# EAGLE design Counter (EAGLE 9.1.1)
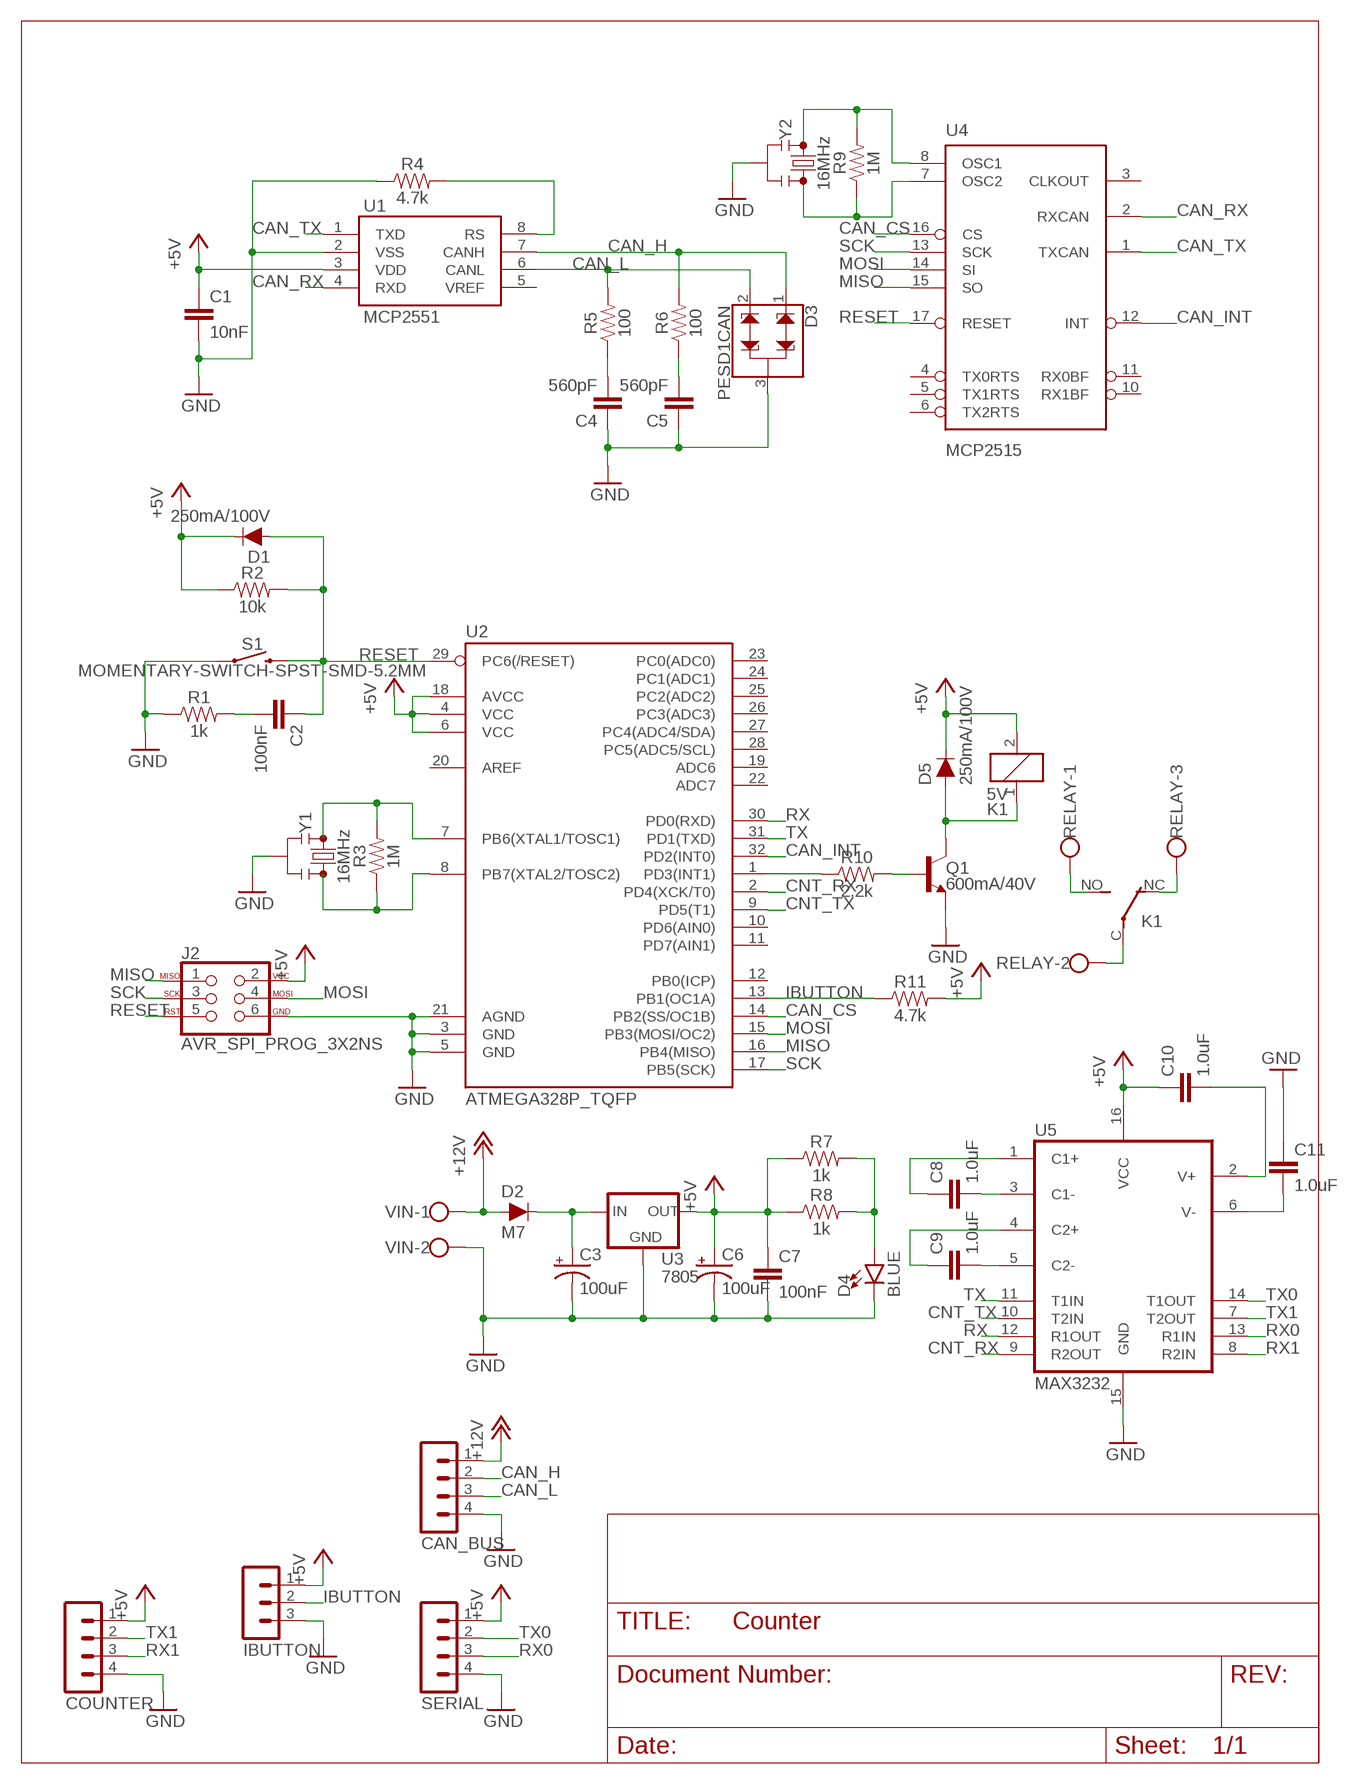
[diagram p0: schematic, sheet 1]

## Parts
C1  10nF  47NF-0603-25V-5%  [0603]
C2  100nF  47NF-0603-25V-5%  [0603]
C3  100uF  47UF-POLAR-PANASONIC_D-35V-20%  [PANASONIC_D]
C4  560pF  560PF-0603-50V-5%  [0603]
C5  560pF  560PF-0603-50V-5%  [0603]
C6  100uF  47UF-POLAR-PANASONIC_D-35V-20%  [PANASONIC_D]
C7  100nF  47NF-0603-25V-5%  [0603]
C8  1.0uF  1.0UF-0603-16V-10%  [0603]
C9  1.0uF  1.0UF-0603-16V-10%  [0603]
C10  1.0uF  1.0UF-0603-16V-10%  [0603]
C11  1.0uF  1.0UF-0603-16V-10%  [0603]
CAN_BUS  MA04-1  [MA04-1]
COUNTER  MA04-1  [MA04-1]
D1  250mA/100V  DIODE-BAS16J  [SOD-323]
D2  M7  DIODE-BAS16J  [SOD-323]
D3  PESD1CAN  [SOT23-3]
D4  BLUE  LED-BLUE0603  [LED-0603]
D5  250mA/100V  DIODE-BAS16J  [SOD-323]
IBUTTON  MA03-1  [MA03-1]
J2  AVR_SPI_PROG_3X2NS  [2X3-NS]
K1  5V  CQ1-12V  [CQ1]
Q1  600mA/40V  TRANS_NPN-MMBT2222AL  [SOT23-3]
R1  1k  1KOHM-0603-1/10W-1%  [0603]
R2  10k  10KOHM-0603-1/10W-1%  [0603]
R3  1M  1MOHM-0603-1/4W-5%  [0603]
R4  4.7k  4.7KOHM-0603-1/10W-1%  [0603]
R5  100  100OHM-0603-1/10W-1%  [0603]
R6  100  100OHM-0603-1/10W-1%  [0603]
R7  1k  1KOHM-0603-1/10W-1%  [0603]
R8  1k  1KOHM-0603-1/10W-1%  [0603]
R9  1M  1MOHM-0603-1/4W-5%  [0603]
R10  2.2k  2.2KOHM-0603-1/10W-1%  [0603]
R11  4.7k  4.7KOHM-0603-1/10W-1%  [0603]
RELAY  W237-103  [W237-103]
S1  MOMENTARY-SWITCH-SPST-SMD-5.2MM  [TACTILE_SWITCH_SMD_5.2MM]
SERIAL  MA04-1  [MA04-1]
U1  MCP2551  [SO08]
U2  ATMEGA328P_TQFP  [TQFP32-08]
U3  7805  V_REG_78XX7812  [TO-252]
U4  MCP2515  MCP2515(MCP2510)SO  [SO18W]
U5  MAX3232  MAX2323SOIC16  [SO16]
VIN  W237-102  [W237-102]
Y1  16MHz  RESONATOR-16MHZSMD_3.2X1.3  [RESONATOR-SMD-3.2X1.3]
Y2  16MHz  RESONATOR-16MHZSMD_3.2X1.3  [RESONATOR-SMD-3.2X1.3]

## Nets
+5V: C1.1 C6.+ C7.1 C10.1 COUNTER.1 D1.C D5.C IBUTTON.1 J2.2 K1.2 R2.1 R7.1 R8.1 R11.2 SERIAL.1 U1.3(VDD) U2.4(VCC) U2.6(VCC) U2.18(AVCC) U3.2(OUT) U5.16(VCC)
+12V: CAN_BUS.1 D2.A VIN.1
CAN_CS: U2.14(PB2(SS/OC1B)) U4.16(CS)
CAN_H: CAN_BUS.2 D3.1 R6.2 U1.7(CANH)
CAN_INT: U2.32(PD2(INT0)) U4.12(INT)
CAN_L: CAN_BUS.3 D3.2 R5.2 U1.6(CANL)
CAN_RX: U1.4(RXD) U4.2(RXCAN)
CAN_TX: U1.1(TXD) U4.1(TXCAN)
CNT_RX: U2.2(PD4(XCK/T0)) U5.9(R2OUT)
CNT_TX: U2.9(PD5(T1)) U5.10(T2IN)
GND: C1.2 C3.- C4.1 C5.1 C6.- C7.2 C11.1 CAN_BUS.4 COUNTER.4 D3.3 D4.C IBUTTON.3 J2.6 Q1.2(E) R1.1 R4.1 S1.1 SERIAL.4 U1.2(VSS) U2.3(GND) U2.5(GND) U2.21(AGND) U3.3(GND) U5.15(GND) VIN.2 Y1.2 Y2.2
IBUTTON: IBUTTON.2 R11.1 U2.13(PB1(OC1A))
MISO: J2.1 U2.16(PB4(MISO)) U4.15(SO)
MOSI: J2.4 U2.15(PB3(MOSI/OC2)) U4.14(SI)
N$1: R3.1 U2.8(PB7(XTAL2/TOSC2)) Y1.3
N$2: C3.+ D2.C U3.1(IN)
N$3: R3.2 U2.7(PB6(XTAL1/TOSC1)) Y1.1
N$4: D4.A R7.2 R8.2
N$5: R4.2 U1.8(RS)
N$6: C2.2 R1.2
N$7: K1.NO(2:S) RELAY.1
N$8: C5.2 R6.1
N$9: C4.2 R5.1
N$10: K1.NC(2:O) RELAY.3
N$11: K1.C(2:P) RELAY.2
N$12: Q1.1(B) R10.2
N$13: D5.A K1.1 Q1.3(C)
N$14: R10.1 U2.1(PD3(INT1))
N$15: C8.2 U5.3(C1-)
N$16: C8.1 U5.1(C1+)
N$17: R9.1 U4.7(OSC2) Y2.3
N$18: R9.2 U4.8(OSC1) Y2.1
N$19: C9.1 U5.4(C2+)
N$20: C9.2 U5.5(C2-)
N$21: C11.2 U5.6(V-)
N$22: C10.2 U5.2(V+)
RESET: C2.1 D1.A J2.5 R2.2 S1.3 U2.29(PC6(/RESET)) U4.17(RESET)
RX: U2.30(PD0(RXD)) U5.12(R1OUT)
RX0: SERIAL.3 U5.13(R1IN)
RX1: COUNTER.3 U5.8(R2IN)
SCK: J2.3 U2.17(PB5(SCK)) U4.13(SCK)
TX: U2.31(PD1(TXD)) U5.11(T1IN)
TX0: SERIAL.2 U5.14(T1OUT)
TX1: COUNTER.2 U5.7(T2OUT)
Unconnected: U1.5(VREF) U2.10(PD6(AIN0)) U2.11(PD7(AIN1)) U2.12(PB0(ICP)) U2.19(ADC6) U2.20(AREF) U2.22(ADC7) U2.23(PC0(ADC0)) U2.24(PC1(ADC1)) U2.25(PC2(ADC2)) U2.26(PC3(ADC3)) U2.27(PC4(ADC4/SDA)) U2.28(PC5(ADC5/SCL)) U4.3(CLKOUT) U4.4(TX0RTS) U4.5(TX1RTS) U4.6(TX2RTS) U4.10(RX1BF) U4.11(RX0BF)

## Power pins joined to a net without a drawn wire
+5V: U4.18(VDD)
GND: U4.9(VSS)

## Library data of the parts
C1 C2 C7 = SparkFun-Capacitors:47NF: 47nF ceramic capacitors A capacitor is a passive two-terminal electrical component used to store electrical energy temporarily in an electric field.; PROD_ID: CAP-08605; VALUE: 47nF
C3 C6 = SparkFun-Capacitors:47UF-POLAR: 47µF polarized capacitors A capacitor is a passive two-terminal electrical component used to store electrical energy temporarily in an electric field.; PROD_ID: CAP-08478; VALUE: 47uF
C4 C5 = SparkFun-Capacitors:560PF: 0.56nF/560pF ceramic capacitors A capacitor is a passive two-terminal electrical component used to store electrical energy temporarily in an electric field.; PROD_ID: CAP-08749
C8-C11 = SparkFun-Capacitors:1.0UF: 1µF ceramic capacitors A capacitor is a passive two-terminal electrical component used to store electrical energy temporarily in an electric field.; PROD_ID: CAP-00868
CAN_BUS COUNTER SERIAL = con-lstb:MA04-1: PIN HEADER; OC_FARNELL: unknown; OC_NEWARK: unknown
D1 D5 = SparkFun-DiscreteSemi:DIODE: Diode These are standard reverse protection diodes and small signal diodes. SparkFun Products: SparkFun SparkPunk Sound Kit <https://www.sparkfun.com/products/11177> SparkFun ESP8266 Thing <https://www.sparkfun.com/products/13231>; PROD_ID: DIO-09646
D2 = SparkFun-DiscreteSemi:DIODE: Diode These are standard reverse protection diodes and small signal diodes. SparkFun Products: SparkFun SparkPunk Sound Kit <https://www.sparkfun.com/products/11177> SparkFun ESP8266 Thing <https://www.sparkfun.com/products/13231>; PROD_ID: DIO-09646; VALUE: 250mA/100V
D3 = SparkFun-DiscreteSemi:PESD1CAN: CAN bus ESD protection diode PESD1CAN is used to protect two CAN bus lines from ESD. Link to datasheet <http://www.nxp.com/documents/data_sheet/PESD1CAN-U.pdf> SparkFun Products: SparkFun CAN-BUS Shield <https://www.sparkfun.com/products/13262>; PROD_ID: DIO-12501
D4 = SparkFun-LED:LED-BLUE: Blue SMD LED Used in manufacturing of various products at SparkFun Packages: 0603 - SMD 0603 package [Product Link] <http://www.digikey.com/product-detail/en/SMLE12BC7TT86/511-1589-2-ND/1641808> 1206 - SMD1206 package [Product Link] <http://www.digikey.com/product-detail/en/lite-on-inc/LTST-C150TBKT/160-1643-1-ND/573584> SparkFun Products: ESP8266 Thing-Dev Board <https://www.sparkfun.com/products/13711> RedBoard <https://www.sparkfun.com/products/12757>; PROD_ID: DIO-08575
IBUTTON = con-lstb:MA03-1: PIN HEADER; OC_FARNELL: unknown; OC_NEWARK: unknown
J2 = SparkFun-Connectors:AVR_SPI_PROG_3X2: AVR ISP 6 Pin This is the reduced ISP connector for AVR programming. Common on Arduino. This footprint will take up less PCB space and can be used with a 10-pin to 6-pin adapter such as SKU: BOB-08508 **Special note about "TEST_POINT" package. The stop mask is on the top side, so if you want your programming test points to be on the bottom of your board, make sure to place this package on the bottom side of the board. This also ensure that the orientation to program from the bottom side will be correct. SparkFun Products: SparkFun ISP Pogo Adapter <https://www.sparkfun.com/products/11591> - NS Tiny AVR Programmer <https://www.sparkfun.com/products/11801> -PTH
K1 = relay:CQ1-12V: AUTOMOTIVE QUIET RELAY NAiS Source: http://www.mew-europe.com/.. en_ds_61208_0000.pdf; OC_FARNELL: unknown; OC_NEWARK: unknown
Q1 = SparkFun-DiscreteSemi:TRANS_NPN: NPN transistor Current controlled devices typically used to amplify current or used as a switch. BC547 - COM-08928 <http://www.sparkfun.com/products/8928> (TO-92 45V 100mA) (1.Collector 2.Base 3.Emitter) 2N3904 - COM-00521 <http://www.sparkfun.com/products/521> (TO-92 40V 200mA) (1.Emitter 2.Base 3.Collector) P2N2222A - COM-12852 <http://www.sparkfun.com/products/12852> (TO-92 40V 600mA) (1.Collector 2.Base 3.Emitter); PROD_ID: TRANS-08049
R1 R7 R8 = SparkFun-Resistors:1KOHM: 1kΩ resistor A resistor is a passive two-terminal electrical component that implements electrical resistance as a circuit element. Resistors act to reduce current flow, and, at the same time, act to lower voltage levels within circuits. - Wikipedia; PROD_ID: RES-07856
R2 = SparkFun-Resistors:10KOHM: 10kΩ resistor A resistor is a passive two-terminal electrical component that implements electrical resistance as a circuit element. Resistors act to reduce current flow, and, at the same time, act to lower voltage levels within circuits. - Wikipedia; PROD_ID: RES-00824
R3 R9 = SparkFun-Resistors:1MOHM: 1MΩ resistor A resistor is a passive two-terminal electrical component that implements electrical resistance as a circuit element. Resistors act to reduce current flow, and, at the same time, act to lower voltage levels within circuits. - Wikipedia; PROD_ID: RES-07868
R4 R11 = SparkFun-Resistors:4.7KOHM: 4.7kΩ resistor A resistor is a passive two-terminal electrical component that implements electrical resistance as a circuit element. Resistors act to reduce current flow, and, at the same time, act to lower voltage levels within circuits. - Wikipedia; PROD_ID: RES-07857
R5 R6 = SparkFun-Resistors:100OHM: 100Ω resistor A resistor is a passive two-terminal electrical component that implements electrical resistance as a circuit element. Resistors act to reduce current flow, and, at the same time, act to lower voltage levels within circuits. - Wikipedia; PROD_ID: RES-07863
R10 = SparkFun-Resistors:2.2KOHM: 2.2kΩ resistor A resistor is a passive two-terminal electrical component that implements electrical resistance as a circuit element. Resistors act to reduce current flow, and, at the same time, act to lower voltage levels within circuits. - Wikipedia; PROD_ID: RES-08272
RELAY = con-wago-500:W237-103: WAGO SCREW CLAMP; MPN: 237-103; OC_FARNELL: unknown; OC_NEWARK: 18M7116
S1 = SparkFun-Switches:MOMENTARY-SWITCH-SPST: Momentary Switch (Pushbutton) - SPST Normally-open (NO) SPST momentary switches (buttons, pushbuttons). Variants PTH-12MM - 12mm square, through-hole Momentary Pushbutton Switch - 12mm Square <https://www.sparkfun.com/products/9190> (COM-09190) PTH-6.0MM, PTH-6.0MM-KIT - 6.0mm square, through-hole Mini Pushbutton Switch <https://www.sparkfun.com/products/97> (COM-00097) KIT package intended for soldering kit's - only one side of pads' copper is exposed. PTH-RIGHT-ANGLE-KIT - Right-angle, through-hole Right Angle Tactile Button <https://www.sparkfun.com/products/10791> - Used on SparkFun BigTime Watch Kit <https://www.sparkfun.com/products/11734> SMD-12MM - 12mm square, surface-mount Tactile Button - SMD (12mm) <https://www.sparkfun.com/products/12993> (COM-12993) Used on SparkFun PicoBoard <https://www.sparkfun.com/products/11888> SMD-4.5MM - 4.5mm Square Trackball Switch Used on SparkFun Blackberry Trackballer Breakout <https://www.sparkfun.com/products/13169> SMD-4.6MMX2.8MM - 4.60mm x 2.80mm, surface mount Used on SparkFun SAMD21 Mini Breakout <https://www.sparkfun.com/products/13664> SMD-5.2MM, SMD-5.2-REDUNDANT - 5.2mm square, surface-mount Mini Pushbutton Switch - SMD <https://www.sparkfun.com/products/8720> (COM-08720) Used on Arduino Pro Mini <https://www.sparkfun.com/products/11114> REDUNDANT package connects both switch circuits together SMD-6.0X3.5MM - 6.0 x 3.5mm, surface mount Momentary Reset Switch SMD <https://www.sparkfun.com/products/8229> (COM-08229) SMD-6.2MM-TALL - 6.2mm square, surface mount Tactile Button - SMD (6mm) <https://www.sparkfun.com/products/12992> Used on SparkFun Digital Sandbox <https://www.sparkfun.com/products/12651> SMD-RIGHT-ANGLE - Right-angle, surface mount Used on SparkFun Block for Intel® Edison - Arduino <https://www.sparkfun.com/products/13036>; PROD_ID: SWCH-08247; SF_SKU: COM-08720
U1 = SparkFun-IC-Comms:MCP2551: MCP2551 High Speed CAN Transceiver High speed CAN transceiver Datasheet <http://www.sparkfun.com/datasheets/DevTools/Arduino/MCP2551.pdf> SparkFun Products CAN-BUS Shield <https://www.sparkfun.com/products/13262> (DEV-13262) SparkFun OBD-II UART <https://www.sparkfun.com/products/9555> (WIG-09555); PROD_ID: IC-09907
U2 = SparkFun-IC-Microcontroller:ATMEGA328P_TQFP: Popular 328P in QFP Storefront component: ATmega328 - TQFP <https://www.sparkfun.com/products/13448> (COM-13448) Datasheet <http://www.sparkfun.com/datasheets/Components/SMD/ATMega328.pdf> SparkFun Products SparkFun RedBoard - Programmed with Arduino <https://www.sparkfun.com/products/12757> (DEV-12757) Arduino Pro Mini 328 - 5V/16MHz <https://www.sparkfun.com/products/11113> (DEV-11113) Arduino Pro Mini 328 - 3.3V/8MHz <https://www.sparkfun.com/products/11114> (DEV-11114) SparkFun OpenLog <https://www.sparkfun.com/products/13712> (DEV-13712) SparkFun MicroView - OLED Arduino Module <https://www.sparkfun.com/products/12923> (DEV-12923) SparkFun Digital Sandbox <https://www.sparkfun.com/products/12651> (DEV-12651) SparkFun PicoBoard <https://www.sparkfun.com/products/11888> (WIG-11888) Arduino Fio <https://www.sparkfun.com/products/10116> (DEV-10116) LilyPad Arduino 328 Main Board <https://www.sparkfun.com/products/13342> (DEV-13342) SparkFun RedStick <https://www.sparkfun.com/products/13741> (DEV-13741) LilyPad MP3 <https://www.sparkfun.com/products/11013> (DEV-11013) LilyPad Arduino SimpleSnap <https://www.sparkfun.com/products/10941> (DEV-10941) SparkFun Stepoko <https://www.sparkfun.com/products/13899> (ROB-13899) SparkFun Geiger Counter <https://www.sparkfun.com/products/11345> (SEN-11345) SparkFun EL Sequencer <https://www.sparkfun.com/products/12781> (COM-12781) Arduino Pro 328 - 5V/16MHz <https://www.sparkfun.com/products/10915> (DEV-10915) CryptoCape <https://www.sparkfun.com/products/12773> (DEV-12773) SparkFun IR Thermometer Evaluation Board - MLX90614 <https://www.sparkfun.com/products/10740> (SEN-10740) SparkFun RedBot Mainboard <https://www.sparkfun.com/products/12097> (ROB-12097) Arduino Pro 328 - 3.3V/8MHz <https://www.sparkfun.com/products/10914> (DEV-10914) SparkFun Block for Intel® Edison - Arduino <https://www.sparkfun.com/products/13036> (DEV-13036) SparkFun Simon Says - Surface Mount Soldering Kit <https://www.sparkfun.com/products/10935> (KIT-10935) SparkFun 7-Segment Serial Display - Red <https://www.sparkfun.com/products/11441> (COM-11441) SparkFun 7-Segment Serial Display - White <https://www.sparkfun.com/products/11629> (COM-11629) SparkFun 7-Segment Serial Display - Yellow <https://www.sparkfun.com/products/11443> (COM-11443) SparkFun 7-Segment Serial Display - Kelly Green <https://www.sparkfun.com/products/11440> (COM-11440) SparkFun 7-Segment Serial Display - Blue <https://www.sparkfun.com/products/11442> (COM-11442) SparkFun OpenSegment Serial Display - 20mm (Blue) <https://www.sparkfun.com/products/11647> (COM-11647) SparkFun OpenSegment Serial Display - 20mm (Green) <https://www.sparkfun.com/products/11646> (COM-11646) SparkFun OpenSegment Serial Display - 20mm (White) <https://www.sparkfun.com/products/11648> (COM-11648) SparkFun OpenSegment Serial Display - 20mm (Red) <https://www.sparkfun.com/products/11644> (COM-11644) SparkFun OpenSegment Serial Display - 20mm (Yellow) <https://www.sparkfun.com/products/11645> (COM-11645) SparkFun OpenSegment Shield <https://www.sparkfun.com/products/13190> (DEV-13190); PROD_ID: IC-09069
U3 = SparkFun-IC-Power:V_REG_78XX: Voltage Regulator Standard 78xx regulator. IGO (Input Ground Output). Spark Fun Electronics SKU : COM-00107; PROD_ID: VREG-12370; VALUE: +12v
U4 = SparkFun-IC-Comms:MCP2515(MCP2510): CAN controller with SPI interface The MCP2515 controller supercedes the MCP2510 while addressing all errata associated with it. The two devices are pin compatible, either can be used with this device. 18-pin package SOIC Simple SPI interface to any MCU. One-shot mode ensures message transmission is attempted only once Databyte filtering Start-of-Frame (SOF) output Low-power CMOS Technology Datasheet <http://www.sparkfun.com/datasheets/DevTools/Arduino/MCP2515.pdf> SparkFun Products CAN-BUS Shield <https://www.sparkfun.com/products/13262> (DEV-13262); PROD_ID: IC-09906
U5 = SparkFun-IC-Comms:MAX2323: RS232 Transceiver This part covers 232 drivers that are compatible with the MAX3232. Sipex SP3232EB Datasheet <http://cdn.sparkfun.com/datasheets/Components/General%20IC/SP3232EBCA-L.pdf> SparkFun Products SOIC component <https://www.sparkfun.com/products/589> (COM-00589 / IC-08171) Retired DIP component (COM-00316 / IC-08446) SparkFun Transceiver Breakout - MAX3232 <https://www.sparkfun.com/products/11189> (BOB-11189) SparkFun XBee Explorer Serial <https://www.sparkfun.com/products/13225> (WRL-13225); PROD_ID: IC-08171
VIN = con-wago-500:W237-102: WAGO SCREW CLAMP; MPN: 237-102; OC_FARNELL: unknown; OC_NEWARK: 70K9898
Y1 Y2 = SparkFun-Clocks:RESONATOR-16MHZ: 16MHz Resonator Digikey Example <http://www.digikey.com/product-detail/en/murata-electronics-north-america/CSTCE16M0V53-R0/490-1198-1-ND/584635> Frequency: 16MHz Frequency Stability: ±0.3% Frequency Tolerance: ±0.5% Capacitance: 15pF SparkFun Products SparkFun OpenLog <https://www.sparkfun.com/products/13712> SparkFun MicroView - OLED Arduino Module <https://www.sparkfun.com/products/12923>; PROD_ID: XTAL-08900

## Board
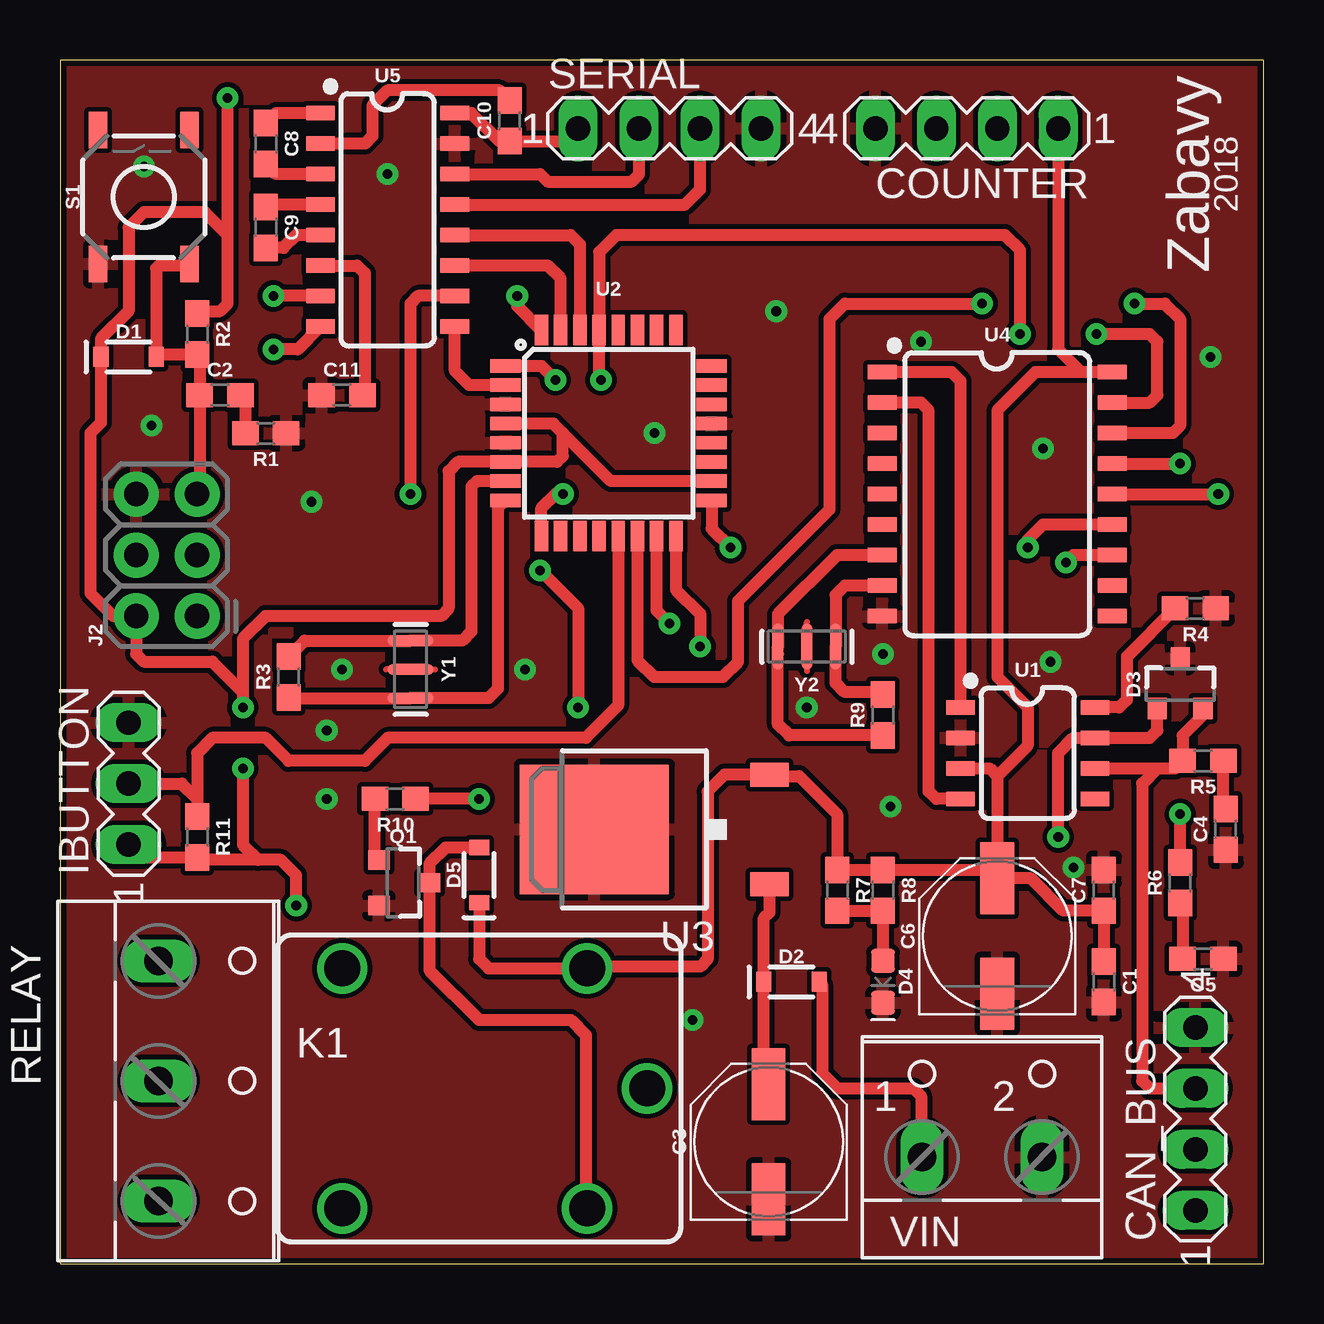
[diagram p1: board, top side]
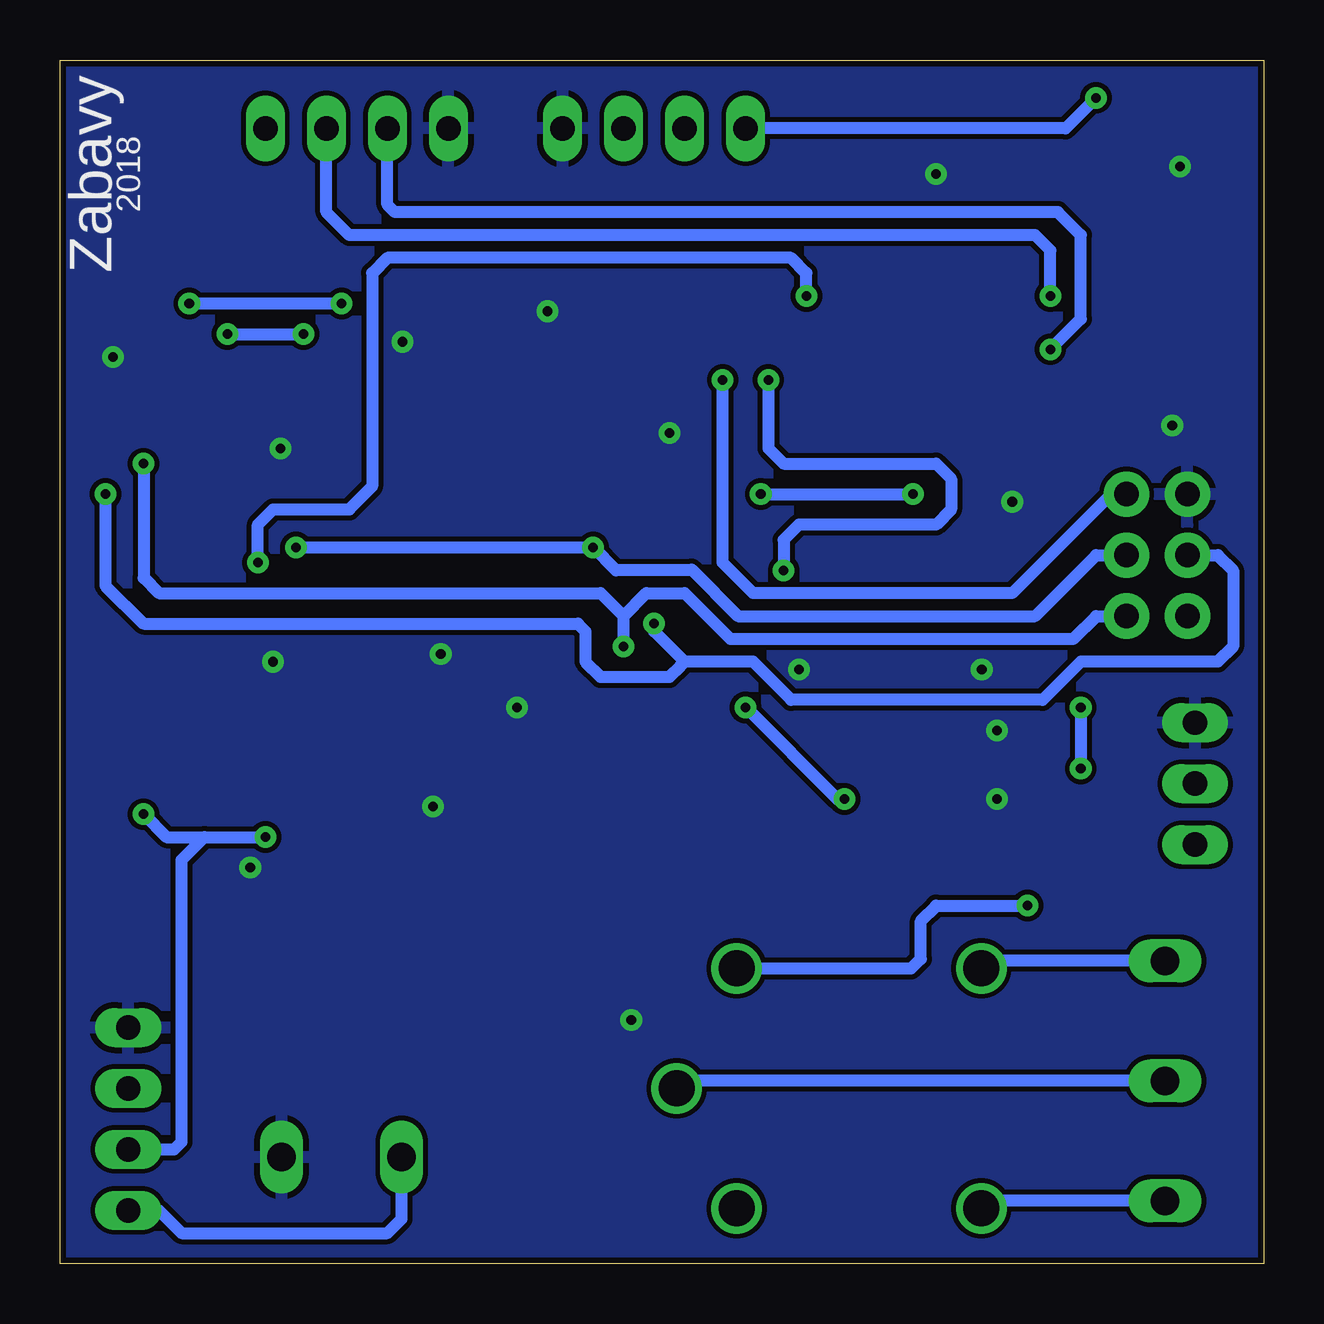
[diagram p2: board, bottom side, seen from below]

Size 50.15 x 50.16 mm. Coordinates in mm from the lower left corner, seen from the top.
Outline: 0,0 50.15,0 50.15,50.16 0,50.16 0,0
Copper layers (1*16): Top 0.035mm / dielectric 1.5mm / Bottom 0.035mm
Design rules "REVISION COLCIRCUITOS": minimum track width 0.23mm, minimum drill 0.4mm, track to track 0.2mm, track to pad 0.2mm, pad to pad 0.2mm, via to via 0.2mm, smd to smd 0mil, copper to edge 0.25mm, drill to drill 0.4mm, minimum pad ring 0.3mm, minimum via ring 0.25mm, stop-mask expansion 0.15mm, vias tented up to drill 0.001mm, thermal gap 10mil

### Footprints (pad centres in the part's own frame; a part is rotated, then mirrored left to right if it is on the bottom)
0603 = smd 1.1 x 1: 1 -0.85,0; 2 0.85,0
PANASONIC_D = smd 3 x 1.4: + 2.4,0; - -2.4,0
MA04-1 = drill 1.016 long: 1 -3.81,0; 2 -1.27,0; 3 1.27,0; 4 3.81,0
SOD-323 = smd 0.63 x 0.83: A 1.15,0; C -1.15,0
SOT23-3 = smd 0.8 x 0.9: 1 -0.95,-1; 2 0.95,-1; 3 0,1.1
LED-0603 = smd 1 x 1: A -0.877,0; C 0.877,0
MA03-1 = drill 1.016 long: 1 -2.54,0; 2 0,0; 3 2.54,0
2X3-NS = drill 1.016 pad 1.88: 1 -2.54,-1.27; 2 -2.54,1.27; 3 0,-1.27; 4 0,1.27; 5 2.54,-1.27; 6 2.54,1.27
CQ1 = drill 1.5: 1 4.5,-5; 2 4.5,5; C 7,0; NC -5.7,-5; NO -5.7,5
W237-103 = drill 1.194 long: 1 -5,-1.29; 2 0,-1.29; 3 5,-1.29
TACTILE_SWITCH_SMD_5.2MM = smd 1.524 x 0.762: 1 -2.794,1.905; 2 2.794,1.905; 3 -2.794,-1.905; 4 2.794,-1.905
SO08 = smd 0.6 x 1.2: 1 -1.905,-2.8; 2 -0.635,-2.8; 3 0.635,-2.8; 4 1.905,-2.8; 5 1.905,2.8; 6 0.635,2.8; 7 -0.635,2.8; 8 -1.905,2.8
TQFP32-08 = smd 1.27 x 0.559: 1 -4.293,2.8; 2 -4.293,2; 3 -4.293,1.2; 4 -4.293,0.4; 5 -4.293,-0.4; 6 -4.293,-1.2; 7 -4.293,-2; 8 -4.293,-2.8; 17 4.293,-2.8; 18 4.293,-2; 19 4.293,-1.2; 20 4.293,-0.4; 21 4.293,0.4; 22 4.293,1.2; 23 4.293,2; 24 4.293,2.8 | smd 0.559 x 1.27: 9 -2.8,-4.293; 10 -2,-4.293; 11 -1.2,-4.293; 12 -0.4,-4.293; 13 0.4,-4.293; 14 1.2,-4.293; 15 2,-4.293; 16 2.8,-4.293; 25 2.8,4.293; 26 2,4.293; 27 1.2,4.293; 28 0.4,4.293; 29 -0.4,4.293; 30 -1.2,4.293; 31 -2,4.293; 32 -2.8,4.293
TO-252 = smd 1 x 1.6: 1 -2.28,-4.8; 2 2.28,-4.8 | smd 5.4 x 6.2: 3 0,2.5
SO18W = smd 0.6 x 1.2: 1 -5.08,-4.788; 2 -3.81,-4.788; 3 -2.54,-4.788; 4 -1.27,-4.788; 5 0,-4.788; 6 1.27,-4.788; 7 2.54,-4.788; 8 3.81,-4.788; 9 5.08,-4.788; 10 5.08,4.788; 11 3.81,4.788; 12 2.54,4.788; 13 1.27,4.788; 14 0,4.788; 15 -1.27,4.788; 16 -2.54,4.788; 17 -3.81,4.788; 18 -5.08,4.788
SO16 = smd 0.6 x 1.2: 1 -4.445,-2.8; 2 -3.175,-2.8; 3 -1.905,-2.8; 4 -0.635,-2.8; 5 0.635,-2.8; 6 1.905,-2.8; 7 3.175,-2.8; 8 4.445,-2.8; 9 4.445,2.8; 10 3.175,2.8; 11 1.905,2.8; 12 0.635,2.8; 13 -0.635,2.8; 14 -1.905,2.8; 15 -3.175,2.8; 16 -4.445,2.8
W237-102 = drill 1.194 long: 1 -2.5,-1.27; 2 2.5,-1.27
RESONATOR-SMD-3.2X1.3 = smd 0.45 x 1.905: 1 -1.2,0; 2 0,0; 3 1.2,0

### Placement (x,y rotation side)
C1  43.5,11.75 270 top
C2  6.67,36.2 0 top
C3  29.53,5.08 90 top
C4  48.58,18.1 90 top
C5  47.62,12.7 180 top
C6  39.05,13.65 90 top
C7  43.5,15.56 90 top
C8  8.57,46.67 270 top
C9  8.57,43.18 270 top
C10  18.73,47.62 90 top
C11  11.75,36.2 0 top
CAN_BUS  47.31,6.03 90 top
COUNTER  37.78,47.31 180 top
D1  2.86,37.78 0 top
D2  30.48,11.75 0 top
D3  46.67,24.13 0 top
D4  34.29,11.75 270 top
D5  17.46,16.19 90 top
IBUTTON  2.86,20 90 top
J2  4.45,29.53 90 top
K1  17.46,7.3 0 top
Q1  14.29,15.88 270 top
R1  8.57,34.61 180 top
R2  5.71,38.73 270 top
R3  9.53,24.45 90 top
R4  47.31,27.3 180 top
R5  47.62,20.95 180 top
R6  46.67,15.88 90 top
R7  32.38,15.56 270 top
R8  34.29,15.56 270 top
R9  34.29,22.86 90 top
R10  13.97,19.37 180 top
R11  5.71,17.78 270 top
RELAY  5.4,7.62 270 top
S1  3.49,44.45 90 top
SERIAL  25.4,47.31 0 top
U1  40.32,21.27 270 top
U2  22.86,34.61 0 top
U3  24.77,18.1 90 top
U4  39.05,32.07 270 top
U5  13.65,43.5 270 top
VIN  38.42,5.71 0 top
Y1  14.61,24.77 270 top
Y2  31.11,25.72 180 top

### Tracks (layer width: path | path; a pad name or v marks a point on that pad's centre or on a via)
+5V  (via drill 0.4)
  Top 0.508: 38.82,16.28 38.7,16.41 R8.1 R7.1 32.38,18.73 30.8,20.32 29.62,20.32 U3.2 27.68,20.38 26.99,19.68 26.99,12.7 26.67,12.38 21.35,12.38 21.27,12.3 | 38.82,16.28 C6.+ 40.46,16.05 41.81,14.71 C7.1 C1.1 | 39.05,20.32 38.73,20.64 U1.3 | 39.05,20.32 39.05,16.51 38.82,16.28 | D5.C 17.46,12.7 17.86,12.3 21.27,12.3 | 21.27,12.3 K1.2 | IBUTTON.1 3.39,16.93 R11.2 5.82,16.83 8.26,16.83 | U4.18 42.55,37.15 | 42.55,37.15 40.64,37.15 39.05,35.56 39.05,24.45 40.32,23.18 40.32,21.59 39.05,20.32 | 20.95,34.61 20.95,33.66 20.71,33.41 U2.6 16.58,33.41 16.19,33.02 16.19,27.3 15.88,26.99 8.57,26.99 7.62,26.04 7.62,23.81 | U2.18 22.95,32.61 20.95,34.61 | v9.84,14.92 9.84,16.19 9.21,16.83 8.26,16.83 | U5.16 17.14,47.94 18.31,46.77 C10.1 21.06,46.77 SERIAL.1 | 7.62,23.81 6.35,25.08 3.49,25.08 3.17,25.4 J2.2 2.22,26.99 1.27,27.94 1.27,34.61 1.71,35.05 D1.C 1.71,38.54 2.86,39.69 2.86,43.18 3.49,43.81 6.03,43.81 6.99,42.86 | 7.62,23.81 v7.62,23.18 | v7.62,20.64 7.62,17.46 8.26,16.83 | 42.55,37.15 41.59,38.1 COUNTER.1 | R2.1 5.82,39.69 6.67,39.69 6.99,40.01 6.99,42.86 | 6.99,42.86 v6.99,48.58 | U2.4 20.55,35.01 20.95,34.61
  Bottom 0.508: K1.2 14.69,12.3 14.29,12.7 14.29,14.29 13.65,14.92 v9.84,14.92 | v7.62,23.18 v7.62,20.64 | v6.99,48.58 8.26,47.31 SERIAL.1
+12V
  Top 0.508: D2.A 31.75,11.63 31.75,7.94 32.38,7.3 35.56,7.3 35.88,6.99 35.88,4.49 VIN.1
  Bottom 0.508: CAN_BUS.1 46.04,2.22 45.09,1.27 36.51,1.27 35.92,1.86 VIN.1
CAN_CS  (via drill 0.4)
  Top 0.508: U2.14 24.06,25.15 24.77,24.45 27.62,24.45 28.26,25.08 28.26,27.62 32.07,31.43 32.07,39.37 32.7,40.01 v38.42,40.01 | v44.77,40.01 46.04,40.01 46.67,39.37 46.67,34.92 46.35,34.61 U4.16
  Bottom 0.508: v38.42,40.01 v44.77,40.01
CAN_H  (via drill 0.4)
  Top 0.508: D3.1 45.72,22.23 45.4,21.91 U1.7 42.23,21.91 41.59,21.27 v41.59,17.78 | R6.2 v46.67,18.73
  Bottom 0.508: CAN_BUS.2 45.4,4.76 45.09,5.08 45.09,16.83 44.13,17.78 | 44.13,17.78 v41.59,17.78 | v46.67,18.73 45.72,17.78 44.13,17.78
CAN_INT  (via drill 0.4)
  Top 0.508: U2.32 19.05,39.91 v19.05,40.32 | U4.12 42.23,29.53 v41.91,29.21
  Bottom 0.508: v19.05,40.32 19.05,41.27 19.68,41.91 36.51,41.91 37.15,41.27 37.15,32.38 38.1,31.43 41.27,31.43 41.91,30.8 v41.91,29.21
CAN_L
  Top 0.508: D3.2 47.62,22.86 46.77,22.01 R5.2 46.46,20.64 45.72,20.64 | U1.6 45.72,20.64 | 45.72,20.64 45.09,20 45.09,7.62 45.4,7.3 CAN_BUS.3
CAN_RX
  Top 0.508: U1.4 36.51,19.37 36.2,19.68 36.2,35.56 35.88,35.88 U4.2
CAN_TX
  Top 0.508: U1.1 37.52,36.77 37.15,37.15 U4.1
CNT_RX
  Top 0.508: U2.2 17.05,36.61 16.45,37.2 U5.9
CNT_TX  (via drill 0.4)
  Top 0.508: U5.10 14.92,40.32 14.61,40.01 v14.61,32.07 | U2.9 20.06,31.49 20.64,32.07 v20.95,32.07
  Bottom 0.508: v20.95,32.07 v14.61,32.07
GND  (via drill 0.4)
  other vias: 11.75,24.77 31.11,23.18 24.77,34.61 3.49,45.72 13.65,45.4 34.29,25.4 42.23,16.51 19.37,24.77 11.11,22.23 11.11,19.37 10.48,31.75 3.81,34.92 40.96,33.97 41.27,25.08 47.94,37.78 34.61,19.05 26.35,10.16 29.84,39.69 35.88,38.42
  pour Top: 0,49.85 0.32,50.16 49.85,50.16 50.16,49.85 50.16,0.32 49.85,0 0.32,0 0,0.32
  pour Bottom: 0,49.85 0.32,50.16 49.85,50.16 50.16,49.85 50.16,0.32 49.85,0 0.32,0 0,0.32
IBUTTON
  Top 0.508: U2.13 23.26,23.26 21.91,21.91 13.65,21.91 12.7,20.95 9.53,20.95 8.57,21.91 6.35,21.91 5.71,21.27 R11.1 5.71,19.37 5.08,20 IBUTTON.2
MISO  (via drill 0.4)
  Top 0.508: v26.67,25.72 26.67,27.08 25.66,28.09 U2.16 | U4.15 v46.67,33.34
  Bottom 0.508: 26.67,26.99 25.72,27.94 24.13,27.94 22.23,26.04 7.94,26.04 6.99,26.99 J2.1 | v46.67,33.34 46.67,28.57 46.04,27.94 27.62,27.94 26.67,26.99 | v26.67,25.72 26.67,26.99
MOSI  (via drill 0.4)
  Top 0.508: v25.4,26.67 24.86,27.21 U2.15 | U4.14 v48.26,32.07
  Bottom 0.508: J2.4 1.91,29.53 1.27,28.89 1.27,25.72 1.91,25.08 7.62,25.08 9.21,23.5 19.68,23.5 21.27,25.08 24.13,25.08 | v48.26,32.07 48.26,28.26 46.67,26.67 28.57,26.67 28.26,26.35 28.26,25.08 27.62,24.45 24.77,24.45 24.29,24.92 24.13,25.08 | 24.13,25.08 25.4,26.35 v25.4,26.67
N$1
  Top 0.508: R3.1 9.56,23.57 Y1.3 17.85,23.57 18.25,23.96 18.25,31.49 U2.8
N$2
  Top 0.508: C3.+ 29.33,7.68 D2.C 29.33,14.41 29.57,14.64 U3.1
N$3
  Top 0.508: U2.7 17.37,32.61 17.14,32.38 17.14,26.35 16.76,25.96 Y1.1 10.19,25.96 R3.2
N$4
  Top 0.508: R7.2 R8.2 D4.A
N$5
  Top 0.508: R4.2 44.45,25.3 44.45,23.5 44.13,23.18 U1.8
N$6
  Top 0.508: C2.2 7.72,35.99 R1.2
N$7
  Bottom 0.508: RELAY.1 11.45,12.62 K1.NO
N$8
  Top 0.508: R6.1 46.77,14.92 C5.2
N$9
  Top 0.508: C4.2 48.48,19.05 R5.1
N$10
  Bottom 0.508: RELAY.3 11.45,2.62 K1.NC
N$11
  Bottom 0.508: RELAY.2 24.14,7.62 K1.C
N$12
  Top 0.508: Q1.1 13.12,16.99 R10.2
N$13
  Top 0.508: D5.A 16.07,17.34 15.39,16.66 Q1.3 15.39,12.23 17.46,10.16 21.27,10.16 21.91,9.53 21.91,2.36 K1.1
N$14  (via drill 0.4)
  Top 0.508: U2.1 20.06,37.41 v20.64,36.83 | v21.59,23.18 21.59,27.3 v20,28.89 | v17.46,19.37 R10.1
  Bottom 0.508: v20.64,36.83 20.64,33.97 20,33.34 13.65,33.34 13.02,32.7 13.02,31.43 13.65,30.8 19.37,30.8 20,30.16 v20,28.89 | v21.59,23.18 17.78,19.37 v17.46,19.37
N$15
  Top 0.508: U5.3 8.99,45.4 C8.2
N$16
  Top 0.508: U5.1 8.99,47.94 C8.1
N$17
  Top 0.508: R9.1 30.38,22.01 29.91,22.47 29.91,25.4 Y2.3 29.91,27.06 32.38,29.53 U4.7
N$18
  Top 0.508: R9.2 34.19,23.81 32.7,23.81 32.31,24.2 32.31,25.4 Y2.1 32.31,27.87 32.7,28.26 U4.8
N$19
  Top 0.508: U5.4 8.68,44.13 C9.1
N$20
  Top 0.508: U5.5 9.84,42.86 9.31,42.33 C9.2
N$21
  Top 0.508: U5.6 12.38,41.59 12.7,41.27 12.7,36.3 C11.2
N$22
  Top 0.508: C10.2 18.32,48.88 13.64,48.88 13.02,48.26 13.02,46.99 12.7,46.67 U5.2
RESET  (via drill 0.4)
  Top 0.508: S1.3 5.33,41.59 4.13,41.59 4.01,41.47 D1.A 4.11,37.88 R2.2 5.82,37.78 C2.1 5.82,32.17 J2.5 | v22.54,36.83 22.46,36.91 U2.29 22.46,42.15 23.18,42.86 39.37,42.86 40.01,42.23 v40.01,38.73 | U4.17 45.4,35.88 45.72,36.2 45.72,38.42 45.4,38.73 v43.18,38.73
  Bottom 0.508: J2.5 6.35,32.07 10.48,27.94 21.27,27.94 22.54,29.21 v22.54,36.83 | v43.18,38.73 v40.01,38.73
RX
  Top 0.508: U5.12 21.27,42.86 21.66,42.48 U2.30
RX0
  Top 0.508: U5.13 26.04,44.13 26.67,44.77 SERIAL.3
RX1  (via drill 0.4)
  Top 0.508: U5.8 9.9,38.1 v8.89,38.1
  Bottom 0.508: v8.89,38.1 7.62,39.37 7.62,42.86 8.57,43.81 36.2,43.81 36.51,44.13 COUNTER.3
SCK  (via drill 0.4)
  Top 0.508: U2.17 27.15,30.63 v27.94,29.84 | U4.13 40.96,30.8 40.32,30.16 v40.32,29.84
  Bottom 0.508: J2.3 6.99,29.53 9.53,26.99 21.91,26.99 23.84,28.92 26.99,28.92 26.99,28.89 v27.94,29.84 v40.32,29.84
TX
  Top 0.508: U2.31 20.86,41.05 20.32,41.59 U5.11
TX0
  Top 0.508: U5.14 20,45.4 20.32,45.09 23.81,45.09 24.13,45.4 SERIAL.2
TX1  (via drill 0.4)
  Top 0.508: U5.7 v8.89,40.32
  Bottom 0.508: v8.89,40.32 8.89,42.23 9.53,42.86 38.1,42.86 39.05,43.81 COUNTER.2

### Text on the board
tNames: Zabavy | 2018
bNames: 2018 | Zabavy